# Vivado block design UFBmod_TRX, xc7a100tfgg484-2, Vivado 2020.2
# (continued, part 2 of 3)
current_bd_instance /TRX_rx_FFT_unit/TRX_rx_FFT_calc/delay_rx09_3459minus1024clk

# ---- hierarchy /TRX_rx_FFT_unit/PUSHDATA ----
current_bd_instance /TRX_rx_FFT_unit/PUSHDATA
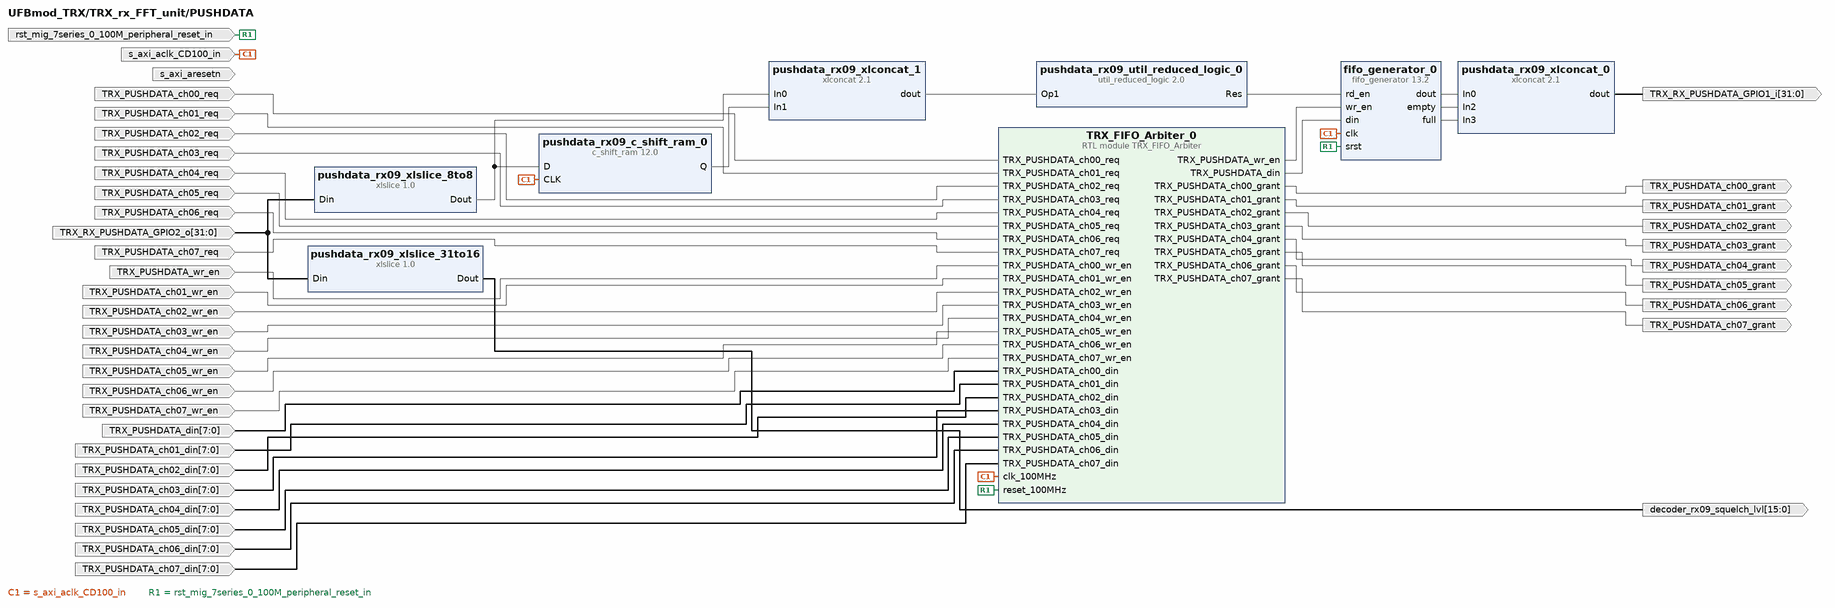
[diagram p12: block diagram inside /TRX_rx_FFT_unit/PUSHDATA]
create_bd_pin -dir I -type clk s_axi_aclk_CD100_in
create_bd_pin -dir I -type rst rst_mig_7series_0_100M_peripheral_reset_in
create_bd_pin -dir I -type rst s_axi_aresetn
create_bd_pin -dir O -from 15 -to 0 decoder_rx09_squelch_lvl
create_bd_pin -dir I TRX_PUSHDATA_wr_en
create_bd_pin -dir I -from 7 -to 0 TRX_PUSHDATA_din
create_bd_pin -dir I TRX_PUSHDATA_ch00_req
create_bd_pin -dir I TRX_PUSHDATA_ch01_req
create_bd_pin -dir I TRX_PUSHDATA_ch02_req
create_bd_pin -dir I TRX_PUSHDATA_ch03_req
create_bd_pin -dir I TRX_PUSHDATA_ch04_req
create_bd_pin -dir I TRX_PUSHDATA_ch05_req
create_bd_pin -dir I TRX_PUSHDATA_ch06_req
create_bd_pin -dir I TRX_PUSHDATA_ch07_req
create_bd_pin -dir O TRX_PUSHDATA_ch00_grant
create_bd_pin -dir O TRX_PUSHDATA_ch01_grant
create_bd_pin -dir O TRX_PUSHDATA_ch02_grant
create_bd_pin -dir O TRX_PUSHDATA_ch03_grant
create_bd_pin -dir O TRX_PUSHDATA_ch04_grant
create_bd_pin -dir O TRX_PUSHDATA_ch05_grant
create_bd_pin -dir O TRX_PUSHDATA_ch06_grant
create_bd_pin -dir O TRX_PUSHDATA_ch07_grant
create_bd_pin -dir I TRX_PUSHDATA_ch01_wr_en
create_bd_pin -dir I TRX_PUSHDATA_ch02_wr_en
create_bd_pin -dir I TRX_PUSHDATA_ch03_wr_en
create_bd_pin -dir I TRX_PUSHDATA_ch04_wr_en
create_bd_pin -dir I TRX_PUSHDATA_ch05_wr_en
create_bd_pin -dir I TRX_PUSHDATA_ch06_wr_en
create_bd_pin -dir I TRX_PUSHDATA_ch07_wr_en
create_bd_pin -dir I -from 7 -to 0 TRX_PUSHDATA_ch01_din
create_bd_pin -dir I -from 7 -to 0 TRX_PUSHDATA_ch02_din
create_bd_pin -dir I -from 7 -to 0 TRX_PUSHDATA_ch03_din
create_bd_pin -dir I -from 7 -to 0 TRX_PUSHDATA_ch04_din
create_bd_pin -dir I -from 7 -to 0 TRX_PUSHDATA_ch05_din
create_bd_pin -dir I -from 7 -to 0 TRX_PUSHDATA_ch06_din
create_bd_pin -dir I -from 7 -to 0 TRX_PUSHDATA_ch07_din
create_bd_pin -dir O -from 31 -to 0 TRX_RX_PUSHDATA_GPIO1_i
create_bd_pin -dir I -from 31 -to 0 TRX_RX_PUSHDATA_GPIO2_o

create_bd_cell -type ip -vlnv xilinx.com:ip:xlslice:1.0 pushdata_rx09_xlslice_31to16
set_property -dict {CONFIG.DIN_FROM 31 CONFIG.DIN_TO 16 CONFIG.DOUT_WIDTH 16} [get_bd_cells pushdata_rx09_xlslice_31to16]
create_bd_cell -type ip -vlnv xilinx.com:ip:xlslice:1.0 pushdata_rx09_xlslice_8to8
create_bd_cell -type ip -vlnv xilinx.com:ip:fifo_generator:13.2 fifo_generator_0
set_property -dict [list \
  CONFIG.Fifo_Implementation Common_Clock_Shift_Register \
  CONFIG.Input_Data_Width 8 \
  CONFIG.Reset_Type Synchronous_Reset \
] [get_bd_cells fifo_generator_0]
create_bd_cell -type ip -vlnv xilinx.com:ip:util_reduced_logic:2.0 pushdata_rx09_util_reduced_logic_0
set_property -dict {CONFIG.C_SIZE 2} [get_bd_cells pushdata_rx09_util_reduced_logic_0]
create_bd_cell -type ip -vlnv xilinx.com:ip:c_shift_ram:12.0 pushdata_rx09_c_shift_ram_0
set_property -dict [list \
  CONFIG.AsyncInitVal 0 \
  CONFIG.DefaultData 0 \
  CONFIG.Depth 1 \
  CONFIG.Width 1 \
] [get_bd_cells pushdata_rx09_c_shift_ram_0]
create_bd_cell -type module -reference TRX_FIFO_Arbiter TRX_FIFO_Arbiter_0
create_bd_cell -type ip -vlnv xilinx.com:ip:xlconcat:2.1 pushdata_rx09_xlconcat_0
set_property -dict [list \
  CONFIG.IN0_WIDTH 8 \
  CONFIG.IN1_WIDTH 22 \
  CONFIG.IN2_WIDTH 1 \
  CONFIG.IN3_WIDTH 1 \
  CONFIG.NUM_PORTS 4 \
  CONFIG.dout_width 32 \
] [get_bd_cells pushdata_rx09_xlconcat_0]
create_bd_cell -type ip -vlnv xilinx.com:ip:xlconcat:2.1 pushdata_rx09_xlconcat_1
set_property -dict {CONFIG.IN0_WIDTH 1 CONFIG.IN1_WIDTH 1} [get_bd_cells pushdata_rx09_xlconcat_1]

# ---- hierarchy /TRX_config ----
current_bd_instance /TRX_config
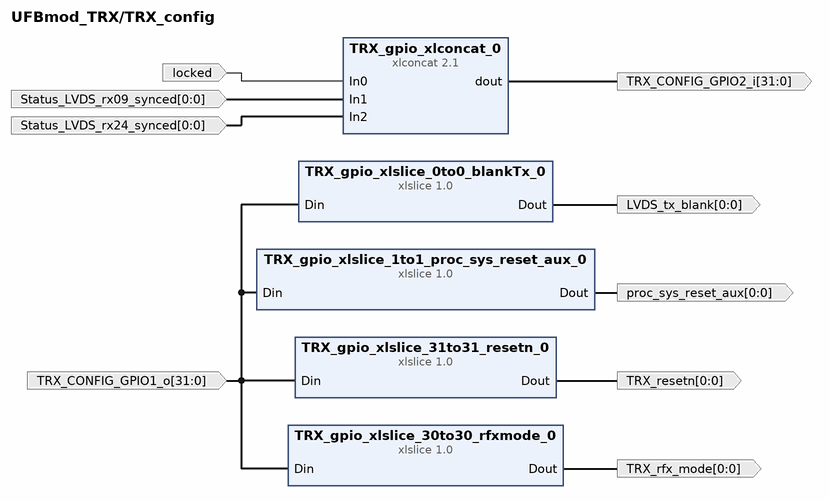
[diagram p13: block diagram inside /TRX_config]
create_bd_pin -dir O -from 0 -to 0 TRX_resetn
create_bd_pin -dir O -from 0 -to 0 TRX_rfx_mode
create_bd_pin -dir I locked
create_bd_pin -dir I -from 0 -to 0 Status_LVDS_rx09_synced
create_bd_pin -dir I -from 0 -to 0 Status_LVDS_rx24_synced
create_bd_pin -dir O -from 0 -to 0 LVDS_tx_blank
create_bd_pin -dir I -from 31 -to 0 TRX_CONFIG_GPIO1_o
create_bd_pin -dir O -from 31 -to 0 TRX_CONFIG_GPIO2_i
create_bd_pin -dir O -from 0 -to 0 proc_sys_reset_aux

create_bd_cell -type ip -vlnv xilinx.com:ip:xlslice:1.0 TRX_gpio_xlslice_31to31_resetn_0
set_property -dict [list \
  CONFIG.DIN_FROM 31 \
  CONFIG.DIN_TO 31 \
  CONFIG.DIN_WIDTH 32 \
  CONFIG.DOUT_WIDTH 1 \
] [get_bd_cells TRX_gpio_xlslice_31to31_resetn_0]
create_bd_cell -type ip -vlnv xilinx.com:ip:xlslice:1.0 TRX_gpio_xlslice_30to30_rfxmode_0
set_property -dict [list \
  CONFIG.DIN_FROM 30 \
  CONFIG.DIN_TO 30 \
  CONFIG.DIN_WIDTH 32 \
  CONFIG.DOUT_WIDTH 1 \
] [get_bd_cells TRX_gpio_xlslice_30to30_rfxmode_0]
create_bd_cell -type ip -vlnv xilinx.com:ip:xlslice:1.0 TRX_gpio_xlslice_0to0_blankTx_0
create_bd_cell -type ip -vlnv xilinx.com:ip:xlslice:1.0 TRX_gpio_xlslice_1to1_proc_sys_reset_aux_0
set_property -dict [list \
  CONFIG.DIN_FROM 1 \
  CONFIG.DIN_TO 1 \
  CONFIG.DOUT_WIDTH 1 \
] [get_bd_cells TRX_gpio_xlslice_1to1_proc_sys_reset_aux_0]
create_bd_cell -type ip -vlnv xilinx.com:ip:xlconcat:2.1 TRX_gpio_xlconcat_0
set_property -dict [list \
  CONFIG.IN0_WIDTH 1 \
  CONFIG.IN1_WIDTH 1 \
  CONFIG.IN2_WIDTH 1 \
  CONFIG.IN3_WIDTH 29 \
  CONFIG.NUM_PORTS 4 \
  CONFIG.dout_width 32 \
] [get_bd_cells TRX_gpio_xlconcat_0]

# ---- hierarchy /TRX_clock ----
current_bd_instance /TRX_clock
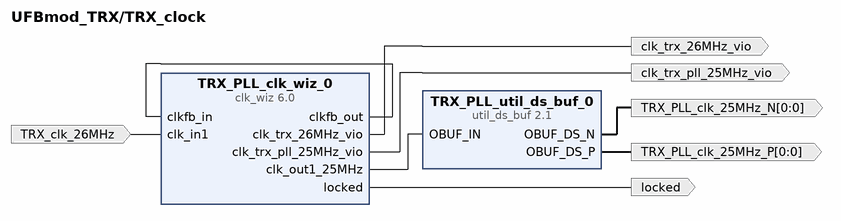
[diagram p14: block diagram inside /TRX_clock]
create_bd_pin -dir I -type clk TRX_clk_26MHz
create_bd_pin -dir O -from 0 -to 0 -type clk TRX_PLL_clk_25MHz_N
create_bd_pin -dir O -from 0 -to 0 -type clk TRX_PLL_clk_25MHz_P
create_bd_pin -dir O -type clk clk_trx_26MHz_vio
create_bd_pin -dir O -type clk clk_trx_pll_25MHz_vio
create_bd_pin -dir O locked

create_bd_cell -type ip -vlnv xilinx.com:ip:clk_wiz:6.0 TRX_PLL_clk_wiz_0
set_property -dict [list \
  CONFIG.CLKIN1_JITTER_PS 100.0 \
  CONFIG.CLKOUT1_DRIVES BUFG \
  CONFIG.CLKOUT1_JITTER 208.558 \
  CONFIG.CLKOUT1_PHASE_ERROR 208.908 \
  CONFIG.CLKOUT1_REQUESTED_OUT_FREQ 25.000 \
  CONFIG.CLKOUT1_USED true \
  CONFIG.CLKOUT2_DRIVES BUFG \
  CONFIG.CLKOUT2_JITTER 206.498 \
  CONFIG.CLKOUT2_PHASE_ERROR 208.908 \
  CONFIG.CLKOUT2_REQUESTED_OUT_FREQ 26.000 \
  CONFIG.CLKOUT2_USED true \
  CONFIG.CLKOUT3_DRIVES BUFG \
  CONFIG.CLKOUT3_JITTER 208.558 \
  CONFIG.CLKOUT3_PHASE_ERROR 208.908 \
  CONFIG.CLKOUT3_REQUESTED_OUT_FREQ 25.000 \
  CONFIG.CLKOUT3_USED true \
  CONFIG.CLKOUT4_DRIVES BUFG \
  CONFIG.CLKOUT5_DRIVES BUFG \
  CONFIG.CLKOUT6_DRIVES BUFG \
  CONFIG.CLKOUT7_DRIVES BUFG \
  CONFIG.CLK_OUT1_PORT clk_out1_25MHz \
  CONFIG.CLK_OUT2_PORT clk_trx_26MHz_vio \
  CONFIG.CLK_OUT3_PORT clk_trx_pll_25MHz_vio \
  CONFIG.FEEDBACK_SOURCE FDBK_ONCHIP \
  CONFIG.MMCM_BANDWIDTH OPTIMIZED \
  CONFIG.MMCM_CLKFBOUT_MULT_F 50 \
  CONFIG.MMCM_CLKIN1_PERIOD 38.462 \
  CONFIG.MMCM_CLKIN2_PERIOD 10.0 \
  CONFIG.MMCM_CLKOUT0_DIVIDE_F 52 \
  CONFIG.MMCM_CLKOUT1_DIVIDE 50 \
  CONFIG.MMCM_CLKOUT2_DIVIDE 52 \
  CONFIG.MMCM_COMPENSATION ZHOLD \
  CONFIG.MMCM_DIVCLK_DIVIDE 1 \
  CONFIG.NUM_OUT_CLKS 3 \
  CONFIG.PRIMITIVE PLL \
  CONFIG.USE_LOCKED true \
  CONFIG.USE_RESET false \
] [get_bd_cells TRX_PLL_clk_wiz_0]
create_bd_cell -type ip -vlnv xilinx.com:ip:util_ds_buf:2.1 TRX_PLL_util_ds_buf_0
set_property -dict {CONFIG.C_BUF_TYPE OBUFDS} [get_bd_cells TRX_PLL_util_ds_buf_0]

# ---- hierarchy /TRX_tx_DDS_unit ----
current_bd_instance /TRX_tx_DDS_unit
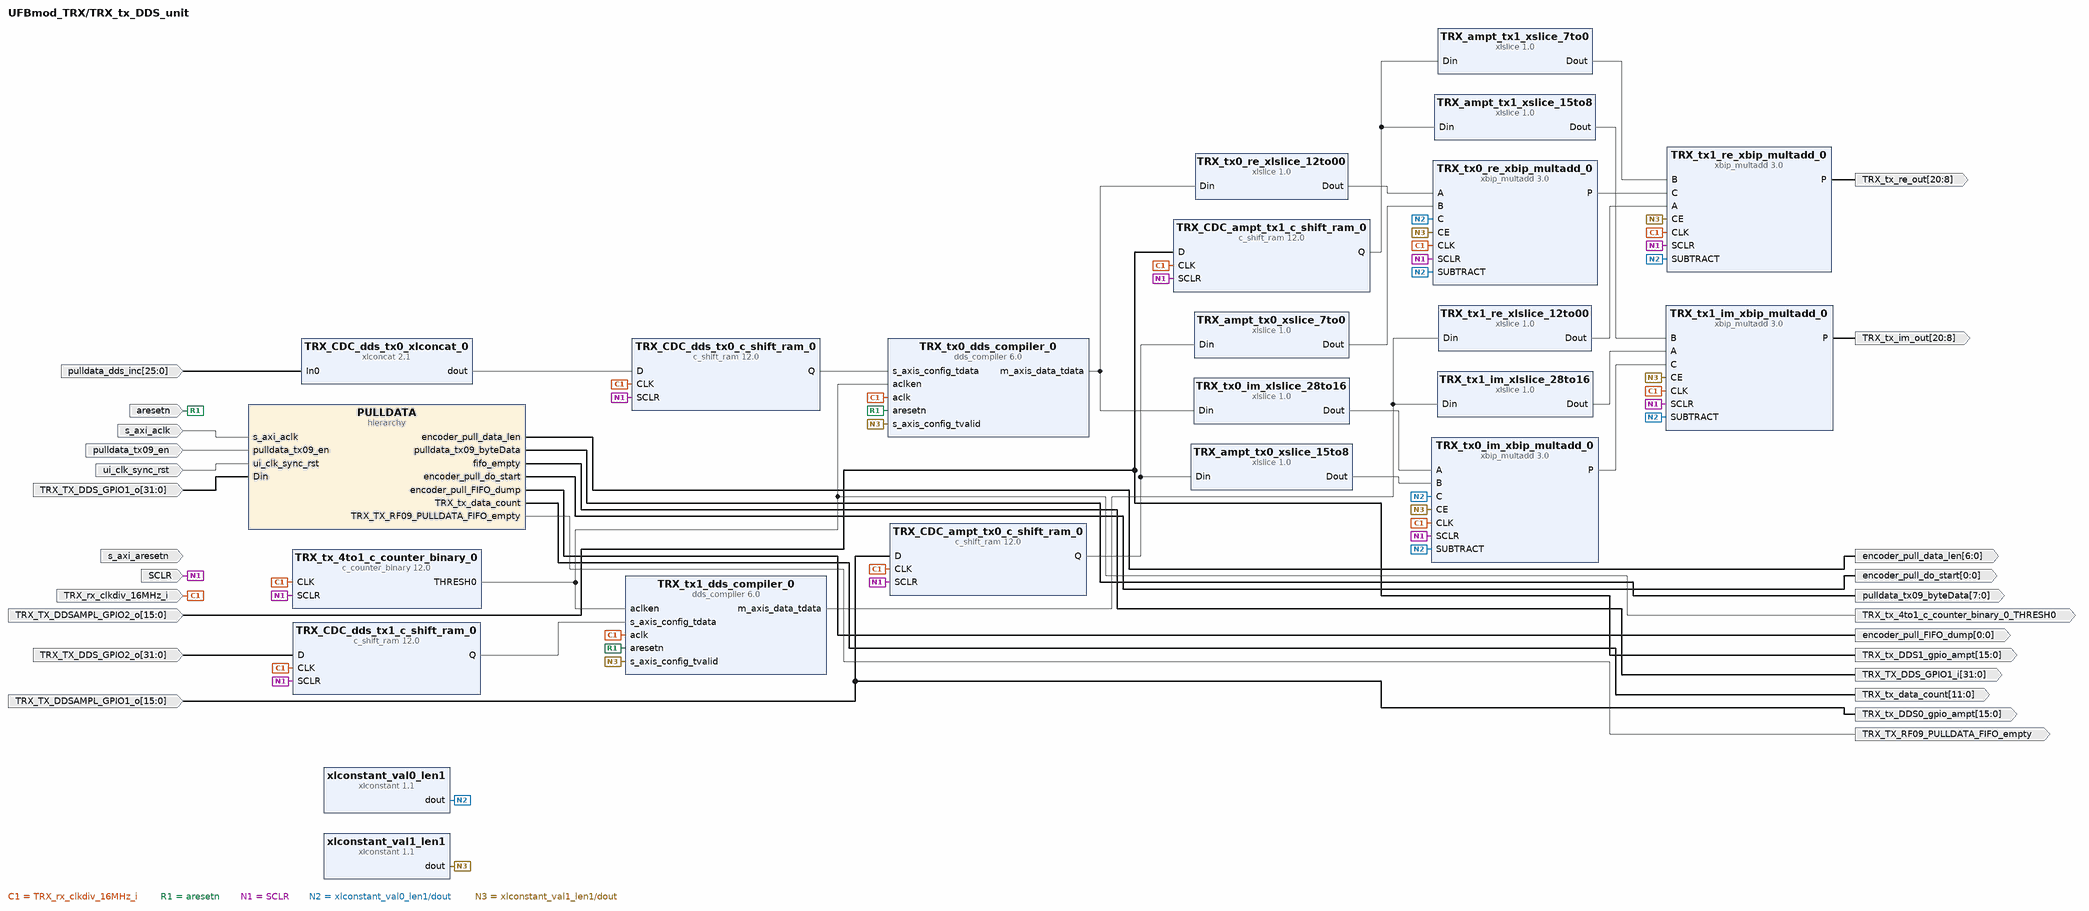
[diagram p15: block diagram inside /TRX_tx_DDS_unit]
create_bd_pin -dir I -type clk TRX_rx_clkdiv_16MHz_i
create_bd_pin -dir I -type rst aresetn
create_bd_pin -dir I -type rst SCLR
create_bd_pin -dir I -type rst s_axi_aresetn
create_bd_pin -dir I -type clk s_axi_aclk
create_bd_pin -dir O -from 20 -to 8 -type data TRX_tx_im_out
create_bd_pin -dir O -from 20 -to 8 -type data TRX_tx_re_out
create_bd_pin -dir O -type data TRX_tx_4to1_c_counter_binary_0_THRESH0
create_bd_pin -dir O -from 6 -to 0 encoder_pull_data_len
create_bd_pin -dir O -from 7 -to 0 pulldata_tx09_byteData
create_bd_pin -dir O -from 0 -to 0 encoder_pull_do_start
create_bd_pin -dir O -from 0 -to 0 encoder_pull_FIFO_dump
create_bd_pin -dir I pulldata_tx09_en
create_bd_pin -dir I ui_clk_sync_rst
create_bd_pin -dir I -from 25 -to 0 -type data pulldata_dds_inc
create_bd_pin -dir O -from 11 -to 0 TRX_tx_data_count
create_bd_pin -dir O TRX_TX_RF09_PULLDATA_FIFO_empty
create_bd_pin -dir O -from 15 -to 0 TRX_tx_DDS0_gpio_ampt
create_bd_pin -dir O -from 15 -to 0 TRX_tx_DDS1_gpio_ampt
create_bd_pin -dir I -from 31 -to 0 -type data TRX_TX_DDS_GPIO2_o
create_bd_pin -dir O -from 31 -to 0 TRX_TX_DDS_GPIO1_i
create_bd_pin -dir I -from 31 -to 0 TRX_TX_DDS_GPIO1_o
create_bd_pin -dir I -from 15 -to 0 -type data TRX_TX_DDSAMPL_GPIO1_o
create_bd_pin -dir I -from 15 -to 0 -type data TRX_TX_DDSAMPL_GPIO2_o

create_bd_cell -type ip -vlnv xilinx.com:ip:c_counter_binary:12.0 TRX_tx_4to1_c_counter_binary_0
set_property -dict [list \
  CONFIG.Final_Count_Value 3 \
  CONFIG.Output_Width 3 \
  CONFIG.Restrict_Count true \
  CONFIG.SCLR true \
  CONFIG.Sync_Threshold_Output true \
  CONFIG.Threshold_Value 3 \
] [get_bd_cells TRX_tx_4to1_c_counter_binary_0]
create_bd_cell -type ip -vlnv xilinx.com:ip:xlslice:1.0 TRX_tx0_re_xlslice_12to00
set_property -dict {CONFIG.DIN_FROM 12 CONFIG.DOUT_WIDTH 13} [get_bd_cells TRX_tx0_re_xlslice_12to00]
create_bd_cell -type ip -vlnv xilinx.com:ip:xlslice:1.0 TRX_tx1_re_xlslice_12to00
set_property -dict {CONFIG.DIN_FROM 12 CONFIG.DOUT_WIDTH 13} [get_bd_cells TRX_tx1_re_xlslice_12to00]
create_bd_cell -type ip -vlnv xilinx.com:ip:xlslice:1.0 TRX_tx0_im_xlslice_28to16
set_property -dict {CONFIG.DIN_FROM 28 CONFIG.DIN_TO 16 CONFIG.DOUT_WIDTH 13} [get_bd_cells TRX_tx0_im_xlslice_28to16]
create_bd_cell -type ip -vlnv xilinx.com:ip:xlslice:1.0 TRX_tx1_im_xlslice_28to16
set_property -dict {CONFIG.DIN_FROM 28 CONFIG.DIN_TO 16 CONFIG.DOUT_WIDTH 13} [get_bd_cells TRX_tx1_im_xlslice_28to16]
create_bd_cell -type ip -vlnv xilinx.com:ip:xbip_multadd:3.0 TRX_tx0_re_xbip_multadd_0
set_property -dict [list \
  CONFIG.c_a_type 0 \
  CONFIG.c_a_width 13 \
  CONFIG.c_b_type 1 \
  CONFIG.c_b_width 8 \
  CONFIG.c_c_type 1 \
  CONFIG.c_c_width 1 \
  CONFIG.c_out_high 20 \
  CONFIG.c_out_low 0 \
] [get_bd_cells TRX_tx0_re_xbip_multadd_0]
create_bd_cell -type ip -vlnv xilinx.com:ip:xbip_multadd:3.0 TRX_tx0_im_xbip_multadd_0
set_property -dict [list \
  CONFIG.c_a_type 0 \
  CONFIG.c_a_width 13 \
  CONFIG.c_b_type 1 \
  CONFIG.c_b_width 8 \
  CONFIG.c_c_type 1 \
  CONFIG.c_c_width 1 \
  CONFIG.c_out_high 20 \
  CONFIG.c_out_low 0 \
] [get_bd_cells TRX_tx0_im_xbip_multadd_0]
create_bd_cell -type ip -vlnv xilinx.com:ip:c_shift_ram:12.0 TRX_CDC_dds_tx0_c_shift_ram_0
set_property -dict [list \
  CONFIG.AsyncInitVal 00000000000000000000000000000000 \
  CONFIG.DefaultData 00000000000000000000000000000000 \
  CONFIG.Depth 2 \
  CONFIG.SCLR true \
  CONFIG.Width 32 \
] [get_bd_cells TRX_CDC_dds_tx0_c_shift_ram_0]
create_bd_cell -type ip -vlnv xilinx.com:ip:c_shift_ram:12.0 TRX_CDC_dds_tx1_c_shift_ram_0
set_property -dict [list \
  CONFIG.AsyncInitVal 00000000000000000000000000000000 \
  CONFIG.DefaultData 00000000000000000000000000000000 \
  CONFIG.Depth 2 \
  CONFIG.SCLR true \
  CONFIG.Width 32 \
] [get_bd_cells TRX_CDC_dds_tx1_c_shift_ram_0]
create_bd_cell -type ip -vlnv xilinx.com:ip:xlslice:1.0 TRX_ampt_tx1_xslice_15to8
set_property -dict [list \
  CONFIG.DIN_FROM 15 \
  CONFIG.DIN_TO 8 \
  CONFIG.DIN_WIDTH 16 \
  CONFIG.DOUT_WIDTH 8 \
] [get_bd_cells TRX_ampt_tx1_xslice_15to8]
create_bd_cell -type ip -vlnv xilinx.com:ip:xlslice:1.0 TRX_ampt_tx1_xslice_7to0
set_property -dict [list \
  CONFIG.DIN_FROM 7 \
  CONFIG.DIN_TO 0 \
  CONFIG.DIN_WIDTH 16 \
  CONFIG.DOUT_WIDTH 8 \
] [get_bd_cells TRX_ampt_tx1_xslice_7to0]
create_bd_cell -type ip -vlnv xilinx.com:ip:xbip_multadd:3.0 TRX_tx1_re_xbip_multadd_0
set_property -dict [list \
  CONFIG.c_a_type 0 \
  CONFIG.c_a_width 13 \
  CONFIG.c_b_type 1 \
  CONFIG.c_b_width 8 \
  CONFIG.c_c_type 0 \
  CONFIG.c_c_width 21 \
  CONFIG.c_out_high 20 \
  CONFIG.c_out_low 8 \
] [get_bd_cells TRX_tx1_re_xbip_multadd_0]
create_bd_cell -type ip -vlnv xilinx.com:ip:xbip_multadd:3.0 TRX_tx1_im_xbip_multadd_0
set_property -dict [list \
  CONFIG.c_a_type 0 \
  CONFIG.c_a_width 13 \
  CONFIG.c_b_type 1 \
  CONFIG.c_b_width 8 \
  CONFIG.c_c_type 0 \
  CONFIG.c_c_width 21 \
  CONFIG.c_out_high 20 \
  CONFIG.c_out_low 8 \
] [get_bd_cells TRX_tx1_im_xbip_multadd_0]
create_bd_cell -type ip -vlnv xilinx.com:ip:dds_compiler:6.0 TRX_tx1_dds_compiler_0
set_property -dict [list \
  CONFIG.Channels 1 \
  CONFIG.DATA_Has_TLAST Not_Required \
  CONFIG.DDS_Clock_Rate 16 \
  CONFIG.DSP48_Use Maximal \
  CONFIG.Frequency_Resolution 0.4 \
  CONFIG.Has_ACLKEN true \
  CONFIG.Has_ARESETn true \
  CONFIG.Has_Phase_Out false \
  CONFIG.Latency 10 \
  CONFIG.M_DATA_Has_TUSER Not_Required \
  CONFIG.M_PHASE_Has_TUSER Not_Required \
  CONFIG.Memory_Type Block_ROM \
  CONFIG.Noise_Shaping Taylor_Series_Corrected \
  CONFIG.Optimization_Goal Speed \
  CONFIG.Output_Frequency1 0 \
  CONFIG.Output_Width 13 \
  CONFIG.PINC1 0 \
  CONFIG.Parameter_Entry Hardware_Parameters \
  CONFIG.Phase_Increment Programmable \
  CONFIG.Phase_Width 32 \
  CONFIG.Phase_offset None \
  CONFIG.S_PHASE_Has_TUSER Not_Required \
] [get_bd_cells TRX_tx1_dds_compiler_0]
create_bd_cell -type ip -vlnv xilinx.com:ip:dds_compiler:6.0 TRX_tx0_dds_compiler_0
set_property -dict [list \
  CONFIG.Channels 1 \
  CONFIG.DATA_Has_TLAST Not_Required \
  CONFIG.DDS_Clock_Rate 16 \
  CONFIG.DSP48_Use Maximal \
  CONFIG.Frequency_Resolution 0.4 \
  CONFIG.Has_ACLKEN true \
  CONFIG.Has_ARESETn true \
  CONFIG.Has_Phase_Out false \
  CONFIG.Latency 10 \
  CONFIG.M_DATA_Has_TUSER Not_Required \
  CONFIG.M_PHASE_Has_TUSER Not_Required \
  CONFIG.Memory_Type Block_ROM \
  CONFIG.Noise_Shaping Taylor_Series_Corrected \
  CONFIG.Optimization_Goal Speed \
  CONFIG.Output_Frequency1 0 \
  CONFIG.Output_Width 13 \
  CONFIG.PINC1 0 \
  CONFIG.Parameter_Entry Hardware_Parameters \
  CONFIG.Phase_Increment Programmable \
  CONFIG.Phase_Width 26 \
  CONFIG.Phase_offset None \
  CONFIG.S_PHASE_Has_TUSER Not_Required \
] [get_bd_cells TRX_tx0_dds_compiler_0]
create_bd_cell -type ip -vlnv xilinx.com:ip:xlconstant:1.1 xlconstant_val0_len1
set_property -dict {CONFIG.CONST_VAL 0} [get_bd_cells xlconstant_val0_len1]
create_bd_cell -type ip -vlnv xilinx.com:ip:xlconstant:1.1 xlconstant_val1_len1
create_bd_cell -type ip -vlnv xilinx.com:ip:c_shift_ram:12.0 TRX_CDC_ampt_tx0_c_shift_ram_0
set_property -dict {CONFIG.CE false CONFIG.Depth 2 CONFIG.SCLR true CONFIG.Width 16} [get_bd_cells TRX_CDC_ampt_tx0_c_shift_ram_0]
create_bd_cell -type ip -vlnv xilinx.com:ip:c_shift_ram:12.0 TRX_CDC_ampt_tx1_c_shift_ram_0
set_property -dict {CONFIG.Depth 2 CONFIG.SCLR true CONFIG.Width 16} [get_bd_cells TRX_CDC_ampt_tx1_c_shift_ram_0]
create_bd_cell -type ip -vlnv xilinx.com:ip:xlslice:1.0 TRX_ampt_tx0_xslice_15to8
set_property -dict [list \
  CONFIG.DIN_FROM 15 \
  CONFIG.DIN_TO 8 \
  CONFIG.DIN_WIDTH 16 \
  CONFIG.DOUT_WIDTH 8 \
] [get_bd_cells TRX_ampt_tx0_xslice_15to8]
create_bd_cell -type ip -vlnv xilinx.com:ip:xlslice:1.0 TRX_ampt_tx0_xslice_7to0
set_property -dict {CONFIG.DIN_FROM 7 CONFIG.DIN_WIDTH 16 CONFIG.DOUT_WIDTH 8} [get_bd_cells TRX_ampt_tx0_xslice_7to0]
create_bd_cell -type hier PULLDATA
create_bd_cell -type ip -vlnv xilinx.com:ip:xlconcat:2.1 TRX_CDC_dds_tx0_xlconcat_0
set_property -dict {CONFIG.IN0_WIDTH 26 CONFIG.IN1_WIDTH 6 CONFIG.dout_width 32} [get_bd_cells TRX_CDC_dds_tx0_xlconcat_0]

# ---- hierarchy /TRX_tx_DDS_unit/PULLDATA ----
current_bd_instance /TRX_tx_DDS_unit/PULLDATA
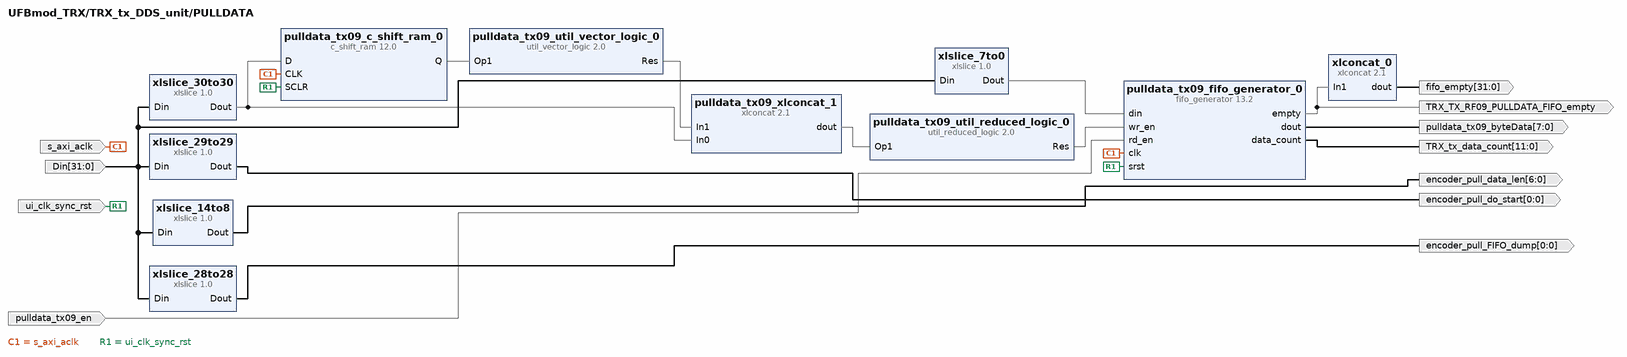
[diagram p16: block diagram inside /TRX_tx_DDS_unit/PULLDATA]
create_bd_pin -dir I -type clk s_axi_aclk
create_bd_pin -dir I -from 31 -to 0 Din
create_bd_pin -dir O -from 6 -to 0 encoder_pull_data_len
create_bd_pin -dir O -from 7 -to 0 pulldata_tx09_byteData
create_bd_pin -dir O -from 31 -to 0 fifo_empty
create_bd_pin -dir O -from 0 -to 0 encoder_pull_do_start
create_bd_pin -dir O -from 0 -to 0 encoder_pull_FIFO_dump
create_bd_pin -dir I pulldata_tx09_en
create_bd_pin -dir I ui_clk_sync_rst
create_bd_pin -dir O -from 11 -to 0 TRX_tx_data_count
create_bd_pin -dir O TRX_TX_RF09_PULLDATA_FIFO_empty

create_bd_cell -type ip -vlnv xilinx.com:ip:fifo_generator:13.2 pulldata_tx09_fifo_generator_0
set_property -dict [list \
  CONFIG.Almost_Empty_Flag false \
  CONFIG.Data_Count true \
  CONFIG.Data_Count_Width 12 \
  CONFIG.Fifo_Implementation Common_Clock_Block_RAM \
  CONFIG.Input_Data_Width 8 \
  CONFIG.Input_Depth 4096 \
  CONFIG.Output_Data_Width 8 \
  CONFIG.Programmable_Empty_Type No_Programmable_Empty_Threshold \
  CONFIG.Reset_Type Synchronous_Reset \
  CONFIG.Underflow_Flag false \
  CONFIG.Use_Dout_Reset true \
  CONFIG.Use_Embedded_Registers true \
  CONFIG.Valid_Flag false \
] [get_bd_cells pulldata_tx09_fifo_generator_0]
create_bd_cell -type ip -vlnv xilinx.com:ip:xlslice:1.0 xlslice_7to0
set_property -dict {CONFIG.DIN_FROM 7 CONFIG.DOUT_WIDTH 8} [get_bd_cells xlslice_7to0]
create_bd_cell -type ip -vlnv xilinx.com:ip:xlslice:1.0 xlslice_30to30
set_property -dict {CONFIG.DIN_FROM 30 CONFIG.DIN_TO 30 CONFIG.DOUT_WIDTH 1} [get_bd_cells xlslice_30to30]
create_bd_cell -type ip -vlnv xilinx.com:ip:c_shift_ram:12.0 pulldata_tx09_c_shift_ram_0
set_property -dict [list \
  CONFIG.AsyncInitVal 0 \
  CONFIG.DefaultData 0 \
  CONFIG.Depth 1 \
  CONFIG.SCLR true \
  CONFIG.Width 1 \
] [get_bd_cells pulldata_tx09_c_shift_ram_0]
create_bd_cell -type ip -vlnv xilinx.com:ip:util_reduced_logic:2.0 pulldata_tx09_util_reduced_logic_0
set_property -dict {CONFIG.C_SIZE 2} [get_bd_cells pulldata_tx09_util_reduced_logic_0]
create_bd_cell -type ip -vlnv xilinx.com:ip:xlslice:1.0 xlslice_14to8
set_property -dict {CONFIG.DIN_FROM 14 CONFIG.DIN_TO 8 CONFIG.DOUT_WIDTH 7} [get_bd_cells xlslice_14to8]
create_bd_cell -type ip -vlnv xilinx.com:ip:xlslice:1.0 xlslice_29to29
set_property -dict {CONFIG.DIN_FROM 29 CONFIG.DIN_TO 29 CONFIG.DOUT_WIDTH 1} [get_bd_cells xlslice_29to29]
create_bd_cell -type ip -vlnv xilinx.com:ip:xlslice:1.0 xlslice_28to28
set_property -dict {CONFIG.DIN_FROM 28 CONFIG.DIN_TO 28 CONFIG.DOUT_WIDTH 1} [get_bd_cells xlslice_28to28]
create_bd_cell -type ip -vlnv xilinx.com:ip:util_vector_logic:2.0 pulldata_tx09_util_vector_logic_0
set_property -dict {CONFIG.C_OPERATION not CONFIG.C_SIZE 1} [get_bd_cells pulldata_tx09_util_vector_logic_0]
create_bd_cell -type ip -vlnv xilinx.com:ip:xlconcat:2.1 pulldata_tx09_xlconcat_1
set_property -dict {CONFIG.IN0_WIDTH 1 CONFIG.IN1_WIDTH 1} [get_bd_cells pulldata_tx09_xlconcat_1]
create_bd_cell -type ip -vlnv xilinx.com:ip:xlconcat:2.1 xlconcat_0
set_property -dict {CONFIG.IN0_WIDTH 31 CONFIG.IN1_WIDTH 1 CONFIG.dout_width 32} [get_bd_cells xlconcat_0]

# ---- connections ----

current_bd_instance /TRX_LVDS
connect_bd_intf_net [get_bd_intf_pins TRX_tx_clk] [get_bd_intf_pins TRX_LVDS_selectio_wiz_0/diff_clk_to_pins]
connect_bd_intf_net [get_bd_intf_pins TRX_rx_clk_64MHz] [get_bd_intf_pins TRX_LVDS_selectio_wiz_0/diff_clk_in]
connect_bd_net -net TRX_LVDS_rx_data_p_1 [get_bd_pins TRX_rx_data_p] [get_bd_pins TRX_LVDS_selectio_wiz_0/data_in_from_pins_p]
connect_bd_net -net TRX_LVDS_rx_data_n_1 [get_bd_pins TRX_rx_data_n] [get_bd_pins TRX_LVDS_selectio_wiz_0/data_in_from_pins_n]
connect_bd_net -net TRX_tx_rf09_selectio_wiz_0_data_out_to_pins_p [get_bd_pins TRX_LVDS_selectio_wiz_0/data_out_to_pins_p] [get_bd_pins TRX_tx_data_p]
connect_bd_net -net TRX_tx_rf09_selectio_wiz_0_data_out_to_pins_n [get_bd_pins TRX_LVDS_selectio_wiz_0/data_out_to_pins_n] [get_bd_pins TRX_tx_data_n]
connect_bd_net -net ref_clock_200MHz_0 [get_bd_pins ref_clock_i] [get_bd_pins TRX_LVDS_selectio_wiz_0/ref_clock]
connect_bd_net -net TRX_LVDS_rx_clkdiv_16MHz [get_bd_pins TRX_LVDS_util_ds_buf_0/BUFG_O] \
  [get_bd_pins TRX_rx_clkdiv_16MHz_o] [get_bd_pins TRX_rx09_fifo_generator_0/wr_clk] \
  [get_bd_pins TRX_rx24_fifo_generator_0/wr_clk] [get_bd_pins TRX_tx09_fifo_generator_0/rd_clk] \
  [get_bd_pins TRX_tx_concat/clk_div_out]
connect_bd_net -net TRX_rx_rf09_LVDS_16bits_CD016_0 [get_bd_pins TRX_LVDS_selectio_wiz_0/data_in_to_device] \
  [get_bd_pins TRX_rx09_concat/Din] [get_bd_pins TRX_rx24_concat/Din]
connect_bd_net -net val1_len1 [get_bd_pins xlconstant_val1_len1/dout] \
  [get_bd_pins TRX_rx09_fifo_generator_0/rd_en] [get_bd_pins TRX_rx09_fifo_generator_0/wr_en] \
  [get_bd_pins TRX_rx24_fifo_generator_0/rd_en] [get_bd_pins TRX_rx24_fifo_generator_0/wr_en] \
  [get_bd_pins TRX_tx09_fifo_generator_0/rd_en] [get_bd_pins TRX_tx09_fifo_generator_0/wr_en]
connect_bd_net -net s_axi_aclk_100MHz_0 [get_bd_pins s_axi_aclk] \
  [get_bd_pins TRX_rx09_fifo_generator_0/rd_clk] [get_bd_pins TRX_rx24_fifo_generator_0/rd_clk]
connect_bd_net -net TRX_LVDS_peripheral_reset_0 [get_bd_pins clk_rst_i] \
  [get_bd_pins TRX_rx09_fifo_generator_0/rst] [get_bd_pins TRX_rx24_fifo_generator_0/rst] \
  [get_bd_pins TRX_tx09_fifo_generator_0/rst]
connect_bd_net -net TRX_rx_rf09_LVDS_concat_CD016_0 [get_bd_pins TRX_rx09_concat/rx09_o] [get_bd_pins TRX_rx09_fifo_generator_0/din]
connect_bd_net -net TRX_rx_rf24_Concat_CD016_0 [get_bd_pins TRX_rx24_concat/rx24_o] [get_bd_pins TRX_rx24_fifo_generator_0/din]
connect_bd_net -net TRX_io_reset_0 [get_bd_pins TRX_io_reset_i] [get_bd_pins TRX_LVDS_selectio_wiz_0/io_reset]
connect_bd_net -net TRX_rx_rf09_FIFO_generator_0_dout_0 [get_bd_pins TRX_rx09_fifo_generator_0/dout] [get_bd_pins TRX_rx09_fifo_o]
connect_bd_net -net TRX_rx_rf24_fifo_generator_0_dout_0 [get_bd_pins TRX_rx24_fifo_generator_0/dout] [get_bd_pins TRX_rx24_fifo_o]
connect_bd_net -net TRX_rx_rf09_FIFO_generator_0_valid_0 [get_bd_pins TRX_rx09_fifo_generator_0/valid] [get_bd_pins TRX_rx09_fifo_valid_o]
connect_bd_net -net TRX_rx_rf24_fifo_generator_0_valid_0 [get_bd_pins TRX_rx24_fifo_generator_0/valid] [get_bd_pins TRX_rx24_fifo_valid_o]
connect_bd_net -net TRX_rx_rf09_FIFO_generator_0_rd_data_count_0 [get_bd_pins TRX_rx09_fifo_generator_0/rd_data_count] \
  [get_bd_pins TRX_rx_rd_data_count]
connect_bd_net -net TRX_tx_rf09_FIFO_dout_0 [get_bd_pins TRX_tx09_fifo_generator_0/dout] [get_bd_pins TRX_tx_concat/TRX_tx09_fifo_dout]
connect_bd_net -net TRX_tx_rf09_LVDS_im_out_0 [get_bd_pins TRX_tx_im_out] [get_bd_pins TRX_tx_concat/TRX_tx_im_out]
connect_bd_net -net TRX_tx_rf09_LVDS_re_out_0 [get_bd_pins TRX_tx_re_out] [get_bd_pins TRX_tx_concat/TRX_tx_re_out]
connect_bd_net -net TRX_LVDS_tx_rf09_DDS_ptt_0 [get_bd_pins TRX_dds_tx_rf09_ptt] [get_bd_pins TRX_tx_concat/TRX_dds_tx_rf09_ptt]
connect_bd_net -net TRX_tx_rf09_FIFO_din_0 [get_bd_pins TRX_tx_concat/TRX_tx09_fifo_din] \
  [get_bd_pins TRX_tx09_fifo_generator_0/din] [get_bd_pins TRX_LVDS_tx09_fifo_din]
connect_bd_net -net TRX_LVDS_tx_rf09_concat_tx_blank_0 [get_bd_pins TRX_config_LVDS_tx_blank_in] \
  [get_bd_pins TRX_tx_concat/TRX_config_LVDS_tx_blank_in]
connect_bd_net -net TRX_tx_rf09_4to1_c_counter_binary_0_THRESH0_4MHz [get_bd_pins TRX_tx_4to1_c_counter_binary_0_THRESH0_4MHz] \
  [get_bd_pins TRX_tx09_fifo_generator_0/wr_clk]
connect_bd_net -net TRX_tx_rf09_Concat_data_out_from_device_in_0 [get_bd_pins TRX_tx_concat/TRX_tx_data_out_from_device_in] \
  [get_bd_pins TRX_LVDS_selectio_wiz_0/data_out_from_device]
connect_bd_net -net rst_mig_7series_0_100M_peripheral_reset_0 [get_bd_pins reset_CD100_i] [get_bd_pins TRX_LVDS_selectio_wiz_0/clk_reset]
connect_bd_net [get_bd_pins TRX_LVDS_selectio_wiz_0/clk_div_out] [get_bd_pins TRX_LVDS_util_ds_buf_0/BUFG_I]
connect_bd_net [get_bd_pins xlconstant_val0_len2/dout] [get_bd_pins TRX_LVDS_selectio_wiz_0/bitslip]

current_bd_instance /TRX_LVDS/TRX_rx09_concat
connect_bd_net -net TRX_rx09_8bits [get_bd_pins TRX_rx09_xlconcat_0/dout] [get_bd_pins rx09_o]
connect_bd_net [get_bd_pins Din] \
  [get_bd_pins TRX_rx_xlslice_00to00/Din] [get_bd_pins TRX_rx_xlslice_02to02/Din] [get_bd_pins TRX_rx_xlslice_04to04/Din] \
  [get_bd_pins TRX_rx_xlslice_06to06/Din] [get_bd_pins TRX_rx_xlslice_10to10/Din] [get_bd_pins TRX_rx_xlslice_12to12/Din] \
  [get_bd_pins TRX_rx_xlslice_14to14/Din] [get_bd_pins TRX_rx_xlslice_08to08/Din]
connect_bd_net -net TRX_rx_xlslice_14to14_Dout [get_bd_pins TRX_rx_xlslice_00to00/Dout] [get_bd_pins TRX_rx09_xlconcat_0/In7]
connect_bd_net -net TRX_rx_xlslice_12to12_Dout [get_bd_pins TRX_rx_xlslice_02to02/Dout] [get_bd_pins TRX_rx09_xlconcat_0/In6]
connect_bd_net -net TRX_rx_xlslice_10to10_Dout [get_bd_pins TRX_rx_xlslice_04to04/Dout] [get_bd_pins TRX_rx09_xlconcat_0/In5]
connect_bd_net -net TRX_rx_xlslice_08to08_Dout [get_bd_pins TRX_rx_xlslice_06to06/Dout] [get_bd_pins TRX_rx09_xlconcat_0/In4]
connect_bd_net -net TRX_rx_xlslice_04to04_Dout [get_bd_pins TRX_rx_xlslice_10to10/Dout] [get_bd_pins TRX_rx09_xlconcat_0/In2]
connect_bd_net -net TRX_rx_xlslice_02to02_Dout [get_bd_pins TRX_rx_xlslice_12to12/Dout] [get_bd_pins TRX_rx09_xlconcat_0/In1]
connect_bd_net -net TRX_rx_xlslice_00to00_Dout [get_bd_pins TRX_rx_xlslice_14to14/Dout] [get_bd_pins TRX_rx09_xlconcat_0/In0]
connect_bd_net -net TRX_rx_xlslice_06to06_Dout [get_bd_pins TRX_rx_xlslice_08to08/Dout] [get_bd_pins TRX_rx09_xlconcat_0/In3]

current_bd_instance /TRX_LVDS/TRX_rx24_concat
connect_bd_net -net TRX_rx24_8bits [get_bd_pins TRX_rx24_xlconcat_0/dout] [get_bd_pins rx24_o]
connect_bd_net [get_bd_pins Din] \
  [get_bd_pins TRX_rx_xlslice_15to15/Din] [get_bd_pins TRX_rx_xlslice_13to13/Din] [get_bd_pins TRX_rx_xlslice_11to11/Din] \
  [get_bd_pins TRX_rx_xlslice_09to09/Din] [get_bd_pins TRX_rx_xlslice_07to07/Din] [get_bd_pins TRX_rx_xlslice_05to05/Din] \
  [get_bd_pins TRX_rx_xlslice_03to03/Din] [get_bd_pins TRX_rx_xlslice_01to01/Din]
connect_bd_net -net TRX_rx_xlslice_01to01_Dout [get_bd_pins TRX_rx_xlslice_15to15/Dout] [get_bd_pins TRX_rx24_xlconcat_0/In0]
connect_bd_net -net TRX_rx_xlslice_03to03_Dout [get_bd_pins TRX_rx_xlslice_13to13/Dout] [get_bd_pins TRX_rx24_xlconcat_0/In1]
connect_bd_net -net TRX_rx_xlslice_05to05_Dout [get_bd_pins TRX_rx_xlslice_11to11/Dout] [get_bd_pins TRX_rx24_xlconcat_0/In2]
connect_bd_net -net TRX_rx_xlslice_07to07_Dout [get_bd_pins TRX_rx_xlslice_09to09/Dout] [get_bd_pins TRX_rx24_xlconcat_0/In3]
connect_bd_net -net TRX_rx_xlslice_09to09_Dout [get_bd_pins TRX_rx_xlslice_07to07/Dout] [get_bd_pins TRX_rx24_xlconcat_0/In4]
connect_bd_net -net TRX_rx_xlslice_11to11_Dout [get_bd_pins TRX_rx_xlslice_05to05/Dout] [get_bd_pins TRX_rx24_xlconcat_0/In5]
connect_bd_net -net TRX_rx_xlslice_13to13_Dout [get_bd_pins TRX_rx_xlslice_03to03/Dout] [get_bd_pins TRX_rx24_xlconcat_0/In6]
connect_bd_net -net TRX_rx_xlslice_15to15_Dout [get_bd_pins TRX_rx_xlslice_01to01/Dout] [get_bd_pins TRX_rx24_xlconcat_0/In7]

current_bd_instance /TRX_LVDS/TRX_tx_concat
connect_bd_net [get_bd_pins xlconstant_val0_len1/dout] \
  [get_bd_pins TRX_tx_LVDS_interleave_xlconcat_0/In1] [get_bd_pins TRX_tx_LVDS_interleave_xlconcat_0/In3] \
  [get_bd_pins TRX_tx_LVDS_interleave_xlconcat_0/In5] [get_bd_pins TRX_tx_LVDS_interleave_xlconcat_0/In7] \
  [get_bd_pins TRX_tx_LVDS_interleave_xlconcat_0/In9] [get_bd_pins TRX_tx_LVDS_interleave_xlconcat_0/In11] \
  [get_bd_pins TRX_tx_LVDS_interleave_xlconcat_0/In13] [get_bd_pins TRX_tx_LVDS_interleave_xlconcat_0/In15] \
  [get_bd_pins TRX_tx_word_format_xlconcat_0/In0] [get_bd_pins TRX_tx_word_format_xlconcat_0/In3] \
  [get_bd_pins TRX_tx_word_format_xlconcat_0/In6]
connect_bd_net [get_bd_pins TRX_tx09_fifo_dout] \
  [get_bd_pins xlslice_07to07/Din] [get_bd_pins xlslice_06to06/Din] [get_bd_pins xlslice_05to05/Din] \
  [get_bd_pins xlslice_04to04/Din] [get_bd_pins xlslice_02to02/Din] [get_bd_pins xlslice_01to01/Din] \
  [get_bd_pins xlslice_00to00/Din] [get_bd_pins xlslice_03to03/Din]
connect_bd_net [get_bd_pins TRX_tx_im_out] [get_bd_pins TRX_tx_word_format_xlconcat_0/In1]
connect_bd_net [get_bd_pins TRX_tx_re_out] [get_bd_pins TRX_tx_word_format_xlconcat_0/In5]
connect_bd_net [get_bd_pins xlconstant_val1_len1/dout] [get_bd_pins TRX_tx_word_format_xlconcat_0/In2] [get_bd_pins TRX_tx_word_format_xlconcat_0/In7]
connect_bd_net -net TRX_tx_PTT_in_0 [get_bd_pins TRX_dds_tx_rf09_ptt] [get_bd_pins TRX_tx_word_format_xlconcat_0/In4]
connect_bd_net [get_bd_pins TRX_blank_tx_xlconcat_0/dout] [get_bd_pins TRX_blank_tx_util_vector_logic_0/Op2]
connect_bd_net -net TRX_config_LVDS_tx_blankn_0 [get_bd_pins TRX_blank_tx_util_vector_logic_1/Res] \
  [get_bd_pins TRX_blank_tx_xlconcat_0/In0] [get_bd_pins TRX_blank_tx_xlconcat_0/In1] \
  [get_bd_pins TRX_blank_tx_xlconcat_0/In2] [get_bd_pins TRX_blank_tx_xlconcat_0/In3] \
  [get_bd_pins TRX_blank_tx_xlconcat_0/In4] [get_bd_pins TRX_blank_tx_xlconcat_0/In5] \
  [get_bd_pins TRX_blank_tx_xlconcat_0/In6] [get_bd_pins TRX_blank_tx_xlconcat_0/In7] \
  [get_bd_pins TRX_blank_tx_xlconcat_0/In8] [get_bd_pins TRX_blank_tx_xlconcat_0/In9] \
  [get_bd_pins TRX_blank_tx_xlconcat_0/In10] [get_bd_pins TRX_blank_tx_xlconcat_0/In11] \
  [get_bd_pins TRX_blank_tx_xlconcat_0/In12] [get_bd_pins TRX_blank_tx_xlconcat_0/In13] \
  [get_bd_pins TRX_blank_tx_xlconcat_0/In14] [get_bd_pins TRX_blank_tx_xlconcat_0/In15]
connect_bd_net [get_bd_pins TRX_config_LVDS_tx_blank_in] [get_bd_pins TRX_blank_tx_c_shift_ram_0/D]
connect_bd_net [get_bd_pins TRX_blank_tx_c_shift_ram_0/Q] [get_bd_pins TRX_blank_tx_util_vector_logic_1/Op1]
connect_bd_net [get_bd_pins TRX_tx_word_format_xlconcat_0/dout] [get_bd_pins TRX_tx09_fifo_din]
connect_bd_net [get_bd_pins TRX_tx_LVDS_interleave_xlconcat_0/dout] [get_bd_pins TRX_blank_tx_util_vector_logic_0/Op1]
connect_bd_net [get_bd_pins TRX_blank_tx_util_vector_logic_0/Res] [get_bd_pins TRX_tx_data_out_from_device_in]
connect_bd_net [get_bd_pins clk_div_out] [get_bd_pins TRX_blank_tx_c_shift_ram_0/CLK]
connect_bd_net [get_bd_pins xlslice_00to00/Dout] [get_bd_pins TRX_tx_LVDS_interleave_xlconcat_0/In14]
connect_bd_net [get_bd_pins xlslice_07to07/Dout] [get_bd_pins TRX_tx_LVDS_interleave_xlconcat_0/In0]
connect_bd_net [get_bd_pins xlslice_06to06/Dout] [get_bd_pins TRX_tx_LVDS_interleave_xlconcat_0/In2]
connect_bd_net [get_bd_pins xlslice_05to05/Dout] [get_bd_pins TRX_tx_LVDS_interleave_xlconcat_0/In4]
connect_bd_net [get_bd_pins xlslice_04to04/Dout] [get_bd_pins TRX_tx_LVDS_interleave_xlconcat_0/In6]
connect_bd_net [get_bd_pins xlslice_03to03/Dout] [get_bd_pins TRX_tx_LVDS_interleave_xlconcat_0/In8]
connect_bd_net [get_bd_pins xlslice_02to02/Dout] [get_bd_pins TRX_tx_LVDS_interleave_xlconcat_0/In10]
connect_bd_net [get_bd_pins xlslice_01to01/Dout] [get_bd_pins TRX_tx_LVDS_interleave_xlconcat_0/In12]

current_bd_instance /TRX_rx_FFT_unit
connect_bd_net -net rst_mig_7series_0_100M_peripheral_reset_0 [get_bd_pins rst_mig_7series_0_100M_peripheral_reset_in] \
  [get_bd_pins TRX_rx_FFT_calc/rst_mig_7series_0_100M_peripheral_reset_in] [get_bd_pins pre_fft_rx09_blk_mem_gen_0/rstb] \
  [get_bd_pins post_fft_rx09_ch00_blk_mem_gen_0/rstb] [get_bd_pins PUSHDATA/rst_mig_7series_0_100M_peripheral_reset_in] \
  [get_bd_pins post_fft_rx09_ch01_blk_mem_gen/rstb] [get_bd_pins post_fft_rx09_ch03_blk_mem_gen/rstb] \
  [get_bd_pins post_fft_rx09_ch04_blk_mem_gen/rstb] [get_bd_pins post_fft_rx09_ch05_blk_mem_gen/rstb] \
  [get_bd_pins post_fft_rx09_ch06_blk_mem_gen/rstb] [get_bd_pins post_fft_rx09_ch07_blk_mem_gen/rstb] \
  [get_bd_pins post_fft_rx09_ch02_blk_mem_gen/rstb] [get_bd_pins TRX_post_fft_rx09_decoder_0/reset_100MHz]
connect_bd_net -net s_axi_aclk_CD100_0 [get_bd_pins s_axi_aclk_CD100_in] \
  [get_bd_pins TRX_rx_FFT_calc/s_axi_aclk_CD100_in] [get_bd_pins post_fft_rx09_ch00_blk_mem_gen_0/clka] \
  [get_bd_pins post_fft_rx09_ch00_blk_mem_gen_0/clkb] [get_bd_pins pre_fft_rx09_blk_mem_gen_0/clka] \
  [get_bd_pins pre_fft_rx09_blk_mem_gen_0/clkb] [get_bd_pins PUSHDATA/s_axi_aclk_CD100_in] \
  [get_bd_pins post_fft_rx09_ch01_blk_mem_gen/clka] [get_bd_pins post_fft_rx09_ch01_blk_mem_gen/clkb] \
  [get_bd_pins post_fft_rx09_ch03_blk_mem_gen/clka] [get_bd_pins post_fft_rx09_ch03_blk_mem_gen/clkb] \
  [get_bd_pins post_fft_rx09_ch04_blk_mem_gen/clka] [get_bd_pins post_fft_rx09_ch04_blk_mem_gen/clkb] \
  [get_bd_pins post_fft_rx09_ch05_blk_mem_gen/clka] [get_bd_pins post_fft_rx09_ch05_blk_mem_gen/clkb] \
  [get_bd_pins post_fft_rx09_ch06_blk_mem_gen/clka] [get_bd_pins post_fft_rx09_ch06_blk_mem_gen/clkb] \
  [get_bd_pins post_fft_rx09_ch07_blk_mem_gen/clka] [get_bd_pins post_fft_rx09_ch07_blk_mem_gen/clkb] \
  [get_bd_pins post_fft_rx09_ch02_blk_mem_gen/clka] [get_bd_pins post_fft_rx09_ch02_blk_mem_gen/clkb] \
  [get_bd_pins TRX_post_fft_rx09_decoder_0/clk_100MHz]
connect_bd_net -net TRX_rx_rf09_FFT_data_tlast_0 [get_bd_pins fft09_data_tlast_in] [get_bd_pins TRX_rx_FFT_calc/fft09_data_tlast_in]
connect_bd_net -net TRX_rx_rf09_FFT_data_tready_0 [get_bd_pins TRX_rx_FFT_calc/fft09_data_tready_out] [get_bd_pins fft09_data_tready_out]
connect_bd_net -net TRX_rx_rf09_FFT_data_tvalid_0 [get_bd_pins fft09_data_tvalid_in] [get_bd_pins TRX_rx_FFT_calc/fft09_data_tvalid_in]
connect_bd_net -net TRX_rx_rf09_FFT_config_tdata_0 [get_bd_pins fft09_config_tdata_in] [get_bd_pins TRX_rx_FFT_calc/fft09_config_tdata_in]
connect_bd_net -net TRX_rx_rf09_FFT_config_tvalid_0 [get_bd_pins fft09_config_tvalid_in] [get_bd_pins TRX_rx_FFT_calc/fft09_config_tvalid_in]
connect_bd_net -net TRX_rx_rf09_FFT_dly3449_event_frame_started_0 [get_bd_pins TRX_rx_FFT_calc/xfft_rx09_dly3449_event_frame_started_out] \
  [get_bd_pins xfft_rx09_dly3449_event_frame_started_out]
connect_bd_net -net TRX_rx_rf09_FFT_dly3449_event_tlast_unexpected_0 [get_bd_pins TRX_rx_FFT_calc/xfft_rx09_dly3449_event_tlast_unexpected_out] \
  [get_bd_pins xfft_rx09_dly3449_event_tlast_unexpected_out]
connect_bd_net -net TRX_rx_rf09_FFT_dly3449_event_tlast_missing_0 [get_bd_pins TRX_rx_FFT_calc/xfft_rx09_dly3449_event_tlast_missing_out] \
  [get_bd_pins xfft_rx09_dly3449_event_tlast_missing_out]
connect_bd_net -net TRX_rx_rf09_FFT_dly3449_event_data_in_channel_halt_0 [get_bd_pins TRX_rx_FFT_calc/xfft_rx09_dly3449_event_data_in_channel_halt_out] \
  [get_bd_pins xfft_rx09_dly3449_event_data_in_channel_halt_out]
connect_bd_net -net TRX_rx_rf09_Post_FFT_mem_magnitude_0 [get_bd_pins TRX_rx_FFT_calc/rx09_postmem_magnitude_out] \
  [get_bd_pins TRX_post_fft_rx09_decoder_0/din]
connect_bd_net -net TRX_rx_rf09_Cordic_rx09_tvalid_0 [get_bd_pins TRX_rx_FFT_calc/cordic_rx09_tvalid_out] \
  [get_bd_pins TRX_post_fft_rx09_decoder_0/tvalid] [get_bd_pins post_fft_mem_a_rx09_xlconcat_0/In1]
connect_bd_net -net TRX_rx_rf09_Pre_FFT_mem_addra_0 [get_bd_pins premem_rx09_addra_in] [get_bd_pins pre_fft_rx09_blk_mem_gen_0/addra]
connect_bd_net -net TRX_rx_rf09_Pre_FFT_mem_dina_0 [get_bd_pins premem_rx09_dina_in] [get_bd_pins pre_fft_rx09_blk_mem_gen_0/dina]
connect_bd_net -net TRX_rx_rf09_Pre_FFT_mem_wea_0 [get_bd_pins premem_rx09_wea_in] [get_bd_pins pre_fft_rx09_blk_mem_gen_0/wea]
connect_bd_net [get_bd_pins TRX_rx_rf09_Pre_FFT_mem_addrb] [get_bd_pins pre_fft_rx09_blk_mem_gen_0/addrb]
connect_bd_net [get_bd_pins TRX_rx_rf09_ch00_Post_FFT_mem_b_addr] [get_bd_pins post_fft_rx09_ch00_blk_mem_gen_0/addrb]
connect_bd_net -net TRX_rx_rf09_ch00_Post_FFT_mem_b_dout_0 [get_bd_pins post_fft_rx09_ch00_blk_mem_gen_0/doutb] \
  [get_bd_pins TRX_rx_rf09_ch00_Post_FFT_mem_b_dout]
connect_bd_net -net TRX_rx_rf09_Pre_FFT_blk_mem_gen_0_doutb_0 [get_bd_pins pre_fft_rx09_blk_mem_gen_0/doutb] \
  [get_bd_pins pre_fft_rx09_xlslice_12to00/Din] [get_bd_pins pre_fft_rx09_xlslice_25to13/Din]
connect_bd_net -net TRX_rx_rf09_FFT_s_data_rx09_re_0 [get_bd_pins pre_fft_rx09_xlslice_12to00/Dout] \
  [get_bd_pins TRX_rx_FFT_calc/fft_s_data_rx09_re_in]
connect_bd_net -net TRX_rx_rf09_FFT_s_data_rx09_im_0 [get_bd_pins pre_fft_rx09_xlslice_25to13/Dout] \
  [get_bd_pins TRX_rx_FFT_calc/fft_s_data_rx09_im_in]
connect_bd_net -net TRX_rx_rf09_uarterfrm_0 [get_bd_pins RF09_quarterfrm] [get_bd_pins TRX_rx_FFT_calc/RF09_quarterfrm]
connect_bd_net -net TRX_rx_rf09_Post_FFT_mem_a_addr_0 [get_bd_pins TRX_rx_FFT_calc/cordic_rx09_m_tuser_out] \
  [get_bd_pins post_fft_rx09_mem_a_addr_out] [get_bd_pins post_fft_rx09_xlslice_9to0/Din]
connect_bd_net -net TRX_rx_rf09_framectr_0 [get_bd_pins RF09_framectr] [get_bd_pins TRX_rx_FFT_calc/RF09_framectr]
connect_bd_net -net TRX_rx_rf09_FFT_window_coef_rom_rx09_0 [get_bd_pins FFT_window_coef_rom_rx09] \
  [get_bd_pins TRX_rx_FFT_calc/FFT_window_coef_rom_rx09]
connect_bd_net -net TRX_rx_rf09_Post_FFT_xlslice_14downto0_dout_0 [get_bd_pins post_fft_rx09_xlslice_9to0/Dout] \
  [get_bd_pins TRX_post_fft_rx09_decoder_0/addr_in] [get_bd_pins post_fft_mem_a_rx09_xlconcat_0/In0]
connect_bd_net -net val1_len1_0 [get_bd_pins xlconstant_val1_len1/dout] \
  [get_bd_pins post_fft_rx09_ch00_blk_mem_gen_0/wea] [get_bd_pins post_fft_rx09_ch01_blk_mem_gen/wea] \
  [get_bd_pins post_fft_rx09_ch03_blk_mem_gen/wea] [get_bd_pins post_fft_rx09_ch04_blk_mem_gen/wea] \
  [get_bd_pins post_fft_rx09_ch05_blk_mem_gen/wea] [get_bd_pins post_fft_rx09_ch06_blk_mem_gen/wea] \
  [get_bd_pins post_fft_rx09_ch07_blk_mem_gen/wea] [get_bd_pins post_fft_rx09_ch02_blk_mem_gen/wea]
connect_bd_net -net TRX_rx_rf09_Post_FFT_mem_a_rx09_xlconcat_0_dout_0 [get_bd_pins post_fft_mem_a_rx09_xlconcat_0/dout] \
  [get_bd_pins post_fft_mem_a_rx09_util_reduced_logic_0/Op1]
connect_bd_net -net TRX_rx_rf09_Post_FFT_mem_a_rx09_util_reduced_logic_0_Res_0 [get_bd_pins post_fft_mem_a_rx09_util_reduced_logic_0/Res] \
  [get_bd_pins post_fft_mem_a_rx09_EoT]
connect_bd_net -net aresetn_CD100_0 [get_bd_pins aresetn_CD100_in] [get_bd_pins PUSHDATA/s_axi_aresetn] [get_bd_pins TRX_rx_FFT_calc/aresetn_CD100_in]
connect_bd_net -net TRX_rx_rf09_PUSHDATA_decoder_rx09_squelch_lvl_0 [get_bd_pins PUSHDATA/decoder_rx09_squelch_lvl] \
  [get_bd_pins decoder_rx09_squelch_lvl]
connect_bd_net -net TRX_rx_rf09_PUSHDATA_wr_en_0 [get_bd_pins TRX_PUSHDATA_wr_en] [get_bd_pins PUSHDATA/TRX_PUSHDATA_wr_en]
connect_bd_net -net TRX_rx_rf09_PUSHDATA_din_0 [get_bd_pins TRX_PUSHDATA_din] [get_bd_pins PUSHDATA/TRX_PUSHDATA_din]
connect_bd_net -net post_fft_rx09_ch00_xlslice_4to0_Dout [get_bd_pins TRX_post_fft_rx09_decoder_0/addr_out] \
  [get_bd_pins post_fft_rx09_ch00_blk_mem_gen_0/addra] [get_bd_pins post_fft_rx09_ch01_blk_mem_gen/addra] \
  [get_bd_pins post_fft_rx09_ch03_blk_mem_gen/addra] [get_bd_pins post_fft_rx09_ch04_blk_mem_gen/addra] \
  [get_bd_pins post_fft_rx09_ch05_blk_mem_gen/addra] [get_bd_pins post_fft_rx09_ch06_blk_mem_gen/addra] \
  [get_bd_pins post_fft_rx09_ch07_blk_mem_gen/addra] [get_bd_pins post_fft_rx09_ch02_blk_mem_gen/addra]
connect_bd_net -net TRX_post_fft_rx09_ad_0_ena_ch00 [get_bd_pins TRX_post_fft_rx09_decoder_0/ena_ch00] \
  [get_bd_pins post_fft_rx09_ch00_blk_mem_gen_0/ena]
connect_bd_net [get_bd_pins TRX_post_fft_rx09_decoder_0/ena_ch01] [get_bd_pins post_fft_rx09_ch01_blk_mem_gen/ena]
connect_bd_net [get_bd_pins TRX_post_fft_rx09_decoder_0/ena_ch03] [get_bd_pins post_fft_rx09_ch03_blk_mem_gen/ena]
connect_bd_net [get_bd_pins TRX_post_fft_rx09_decoder_0/ena_ch04] [get_bd_pins post_fft_rx09_ch04_blk_mem_gen/ena]
connect_bd_net [get_bd_pins TRX_post_fft_rx09_decoder_0/ena_ch05] [get_bd_pins post_fft_rx09_ch05_blk_mem_gen/ena]
connect_bd_net [get_bd_pins TRX_post_fft_rx09_decoder_0/ena_ch06] [get_bd_pins post_fft_rx09_ch06_blk_mem_gen/ena]
connect_bd_net [get_bd_pins TRX_post_fft_rx09_decoder_0/ena_ch07] [get_bd_pins post_fft_rx09_ch07_blk_mem_gen/ena]
connect_bd_net [get_bd_pins TRX_post_fft_rx09_decoder_0/ena_ch02] [get_bd_pins post_fft_rx09_ch02_blk_mem_gen/ena]
connect_bd_net [get_bd_pins TRX_rx_rf09_ch01_Post_FFT_mem_b_addr] [get_bd_pins post_fft_rx09_ch01_blk_mem_gen/addrb]
connect_bd_net [get_bd_pins TRX_rx_rf09_ch02_Post_FFT_mem_b_addr] [get_bd_pins post_fft_rx09_ch02_blk_mem_gen/addrb]
connect_bd_net [get_bd_pins TRX_rx_rf09_ch03_Post_FFT_mem_b_addr] [get_bd_pins post_fft_rx09_ch03_blk_mem_gen/addrb]
connect_bd_net [get_bd_pins TRX_rx_rf09_ch04_Post_FFT_mem_b_addr] [get_bd_pins post_fft_rx09_ch04_blk_mem_gen/addrb]
connect_bd_net [get_bd_pins TRX_rx_rf09_ch05_Post_FFT_mem_b_addr] [get_bd_pins post_fft_rx09_ch05_blk_mem_gen/addrb]
connect_bd_net [get_bd_pins TRX_rx_rf09_ch06_Post_FFT_mem_b_addr] [get_bd_pins post_fft_rx09_ch06_blk_mem_gen/addrb]
connect_bd_net [get_bd_pins TRX_rx_rf09_ch07_Post_FFT_mem_b_addr] [get_bd_pins post_fft_rx09_ch07_blk_mem_gen/addrb]
connect_bd_net [get_bd_pins post_fft_rx09_ch01_blk_mem_gen/doutb] [get_bd_pins TRX_rx_rf09_ch01_Post_FFT_mem_b_dout]
connect_bd_net [get_bd_pins post_fft_rx09_ch02_blk_mem_gen/doutb] [get_bd_pins TRX_rx_rf09_ch02_Post_FFT_mem_b_dout]
connect_bd_net [get_bd_pins post_fft_rx09_ch03_blk_mem_gen/doutb] [get_bd_pins TRX_rx_rf09_ch03_Post_FFT_mem_b_dout]
connect_bd_net [get_bd_pins post_fft_rx09_ch04_blk_mem_gen/doutb] [get_bd_pins TRX_rx_rf09_ch04_Post_FFT_mem_b_dout]
connect_bd_net [get_bd_pins post_fft_rx09_ch05_blk_mem_gen/doutb] [get_bd_pins TRX_rx_rf09_ch05_Post_FFT_mem_b_dout]
connect_bd_net [get_bd_pins post_fft_rx09_ch06_blk_mem_gen/doutb] [get_bd_pins TRX_rx_rf09_ch06_Post_FFT_mem_b_dout]
connect_bd_net [get_bd_pins post_fft_rx09_ch07_blk_mem_gen/doutb] [get_bd_pins TRX_rx_rf09_ch07_Post_FFT_mem_b_dout]
connect_bd_net [get_bd_pins TRX_PUSHDATA_ch00_req] [get_bd_pins PUSHDATA/TRX_PUSHDATA_ch00_req]
connect_bd_net [get_bd_pins TRX_PUSHDATA_ch01_req] [get_bd_pins PUSHDATA/TRX_PUSHDATA_ch01_req]
connect_bd_net [get_bd_pins TRX_PUSHDATA_ch02_req] [get_bd_pins PUSHDATA/TRX_PUSHDATA_ch02_req]
connect_bd_net [get_bd_pins TRX_PUSHDATA_ch03_req] [get_bd_pins PUSHDATA/TRX_PUSHDATA_ch03_req]
connect_bd_net [get_bd_pins TRX_PUSHDATA_ch04_req] [get_bd_pins PUSHDATA/TRX_PUSHDATA_ch04_req]
connect_bd_net [get_bd_pins TRX_PUSHDATA_ch05_req] [get_bd_pins PUSHDATA/TRX_PUSHDATA_ch05_req]
connect_bd_net [get_bd_pins TRX_PUSHDATA_ch06_req] [get_bd_pins PUSHDATA/TRX_PUSHDATA_ch06_req]
connect_bd_net [get_bd_pins TRX_PUSHDATA_ch07_req] [get_bd_pins PUSHDATA/TRX_PUSHDATA_ch07_req]
connect_bd_net [get_bd_pins PUSHDATA/TRX_PUSHDATA_ch00_grant] [get_bd_pins TRX_PUSHDATA_ch00_grant]
connect_bd_net [get_bd_pins PUSHDATA/TRX_PUSHDATA_ch01_grant] [get_bd_pins TRX_PUSHDATA_ch01_grant]
connect_bd_net [get_bd_pins PUSHDATA/TRX_PUSHDATA_ch02_grant] [get_bd_pins TRX_PUSHDATA_ch02_grant]
connect_bd_net [get_bd_pins PUSHDATA/TRX_PUSHDATA_ch03_grant] [get_bd_pins TRX_PUSHDATA_ch03_grant]
connect_bd_net [get_bd_pins PUSHDATA/TRX_PUSHDATA_ch04_grant] [get_bd_pins TRX_PUSHDATA_ch04_grant]
connect_bd_net [get_bd_pins PUSHDATA/TRX_PUSHDATA_ch05_grant] [get_bd_pins TRX_PUSHDATA_ch05_grant]
connect_bd_net [get_bd_pins PUSHDATA/TRX_PUSHDATA_ch06_grant] [get_bd_pins TRX_PUSHDATA_ch06_grant]
connect_bd_net [get_bd_pins PUSHDATA/TRX_PUSHDATA_ch07_grant] [get_bd_pins TRX_PUSHDATA_ch07_grant]
connect_bd_net [get_bd_pins TRX_PUSHDATA_ch01_wr_en] [get_bd_pins PUSHDATA/TRX_PUSHDATA_ch01_wr_en]
connect_bd_net [get_bd_pins TRX_PUSHDATA_ch02_wr_en] [get_bd_pins PUSHDATA/TRX_PUSHDATA_ch02_wr_en]
connect_bd_net [get_bd_pins TRX_PUSHDATA_ch03_wr_en] [get_bd_pins PUSHDATA/TRX_PUSHDATA_ch03_wr_en]
connect_bd_net [get_bd_pins TRX_PUSHDATA_ch04_wr_en] [get_bd_pins PUSHDATA/TRX_PUSHDATA_ch04_wr_en]
connect_bd_net [get_bd_pins TRX_PUSHDATA_ch05_wr_en] [get_bd_pins PUSHDATA/TRX_PUSHDATA_ch05_wr_en]
connect_bd_net [get_bd_pins TRX_PUSHDATA_ch06_wr_en] [get_bd_pins PUSHDATA/TRX_PUSHDATA_ch06_wr_en]
connect_bd_net [get_bd_pins TRX_PUSHDATA_ch07_wr_en] [get_bd_pins PUSHDATA/TRX_PUSHDATA_ch07_wr_en]
connect_bd_net [get_bd_pins TRX_PUSHDATA_ch01_din] [get_bd_pins PUSHDATA/TRX_PUSHDATA_ch01_din]
connect_bd_net [get_bd_pins TRX_PUSHDATA_ch02_din] [get_bd_pins PUSHDATA/TRX_PUSHDATA_ch02_din]
connect_bd_net [get_bd_pins TRX_PUSHDATA_ch03_din] [get_bd_pins PUSHDATA/TRX_PUSHDATA_ch03_din]
connect_bd_net [get_bd_pins TRX_PUSHDATA_ch04_din] [get_bd_pins PUSHDATA/TRX_PUSHDATA_ch04_din]
connect_bd_net [get_bd_pins TRX_PUSHDATA_ch05_din] [get_bd_pins PUSHDATA/TRX_PUSHDATA_ch05_din]
connect_bd_net [get_bd_pins TRX_PUSHDATA_ch06_din] [get_bd_pins PUSHDATA/TRX_PUSHDATA_ch06_din]
connect_bd_net [get_bd_pins TRX_PUSHDATA_ch07_din] [get_bd_pins PUSHDATA/TRX_PUSHDATA_ch07_din]
connect_bd_net [get_bd_pins TRX_post_fft_rx09_decoder_0/dout] \
  [get_bd_pins post_fft_rx09_ch02_blk_mem_gen/dina] [get_bd_pins post_fft_rx09_ch07_blk_mem_gen/dina] \
  [get_bd_pins post_fft_rx09_ch06_blk_mem_gen/dina] [get_bd_pins post_fft_rx09_ch05_blk_mem_gen/dina] \
  [get_bd_pins post_fft_rx09_ch04_blk_mem_gen/dina] [get_bd_pins post_fft_rx09_ch03_blk_mem_gen/dina] \
  [get_bd_pins post_fft_rx09_ch01_blk_mem_gen/dina] [get_bd_pins post_fft_rx09_ch00_blk_mem_gen_0/dina]
connect_bd_net [get_bd_pins PUSHDATA/TRX_RX_PUSHDATA_GPIO1_i] [get_bd_pins TRX_RX_PUSHDATA_GPIO1_i]
connect_bd_net [get_bd_pins TRX_RX_PUSHDATA_GPIO2_o] [get_bd_pins PUSHDATA/TRX_RX_PUSHDATA_GPIO2_o]
